# Altium schematic sheet Main.SchDoc
size A3
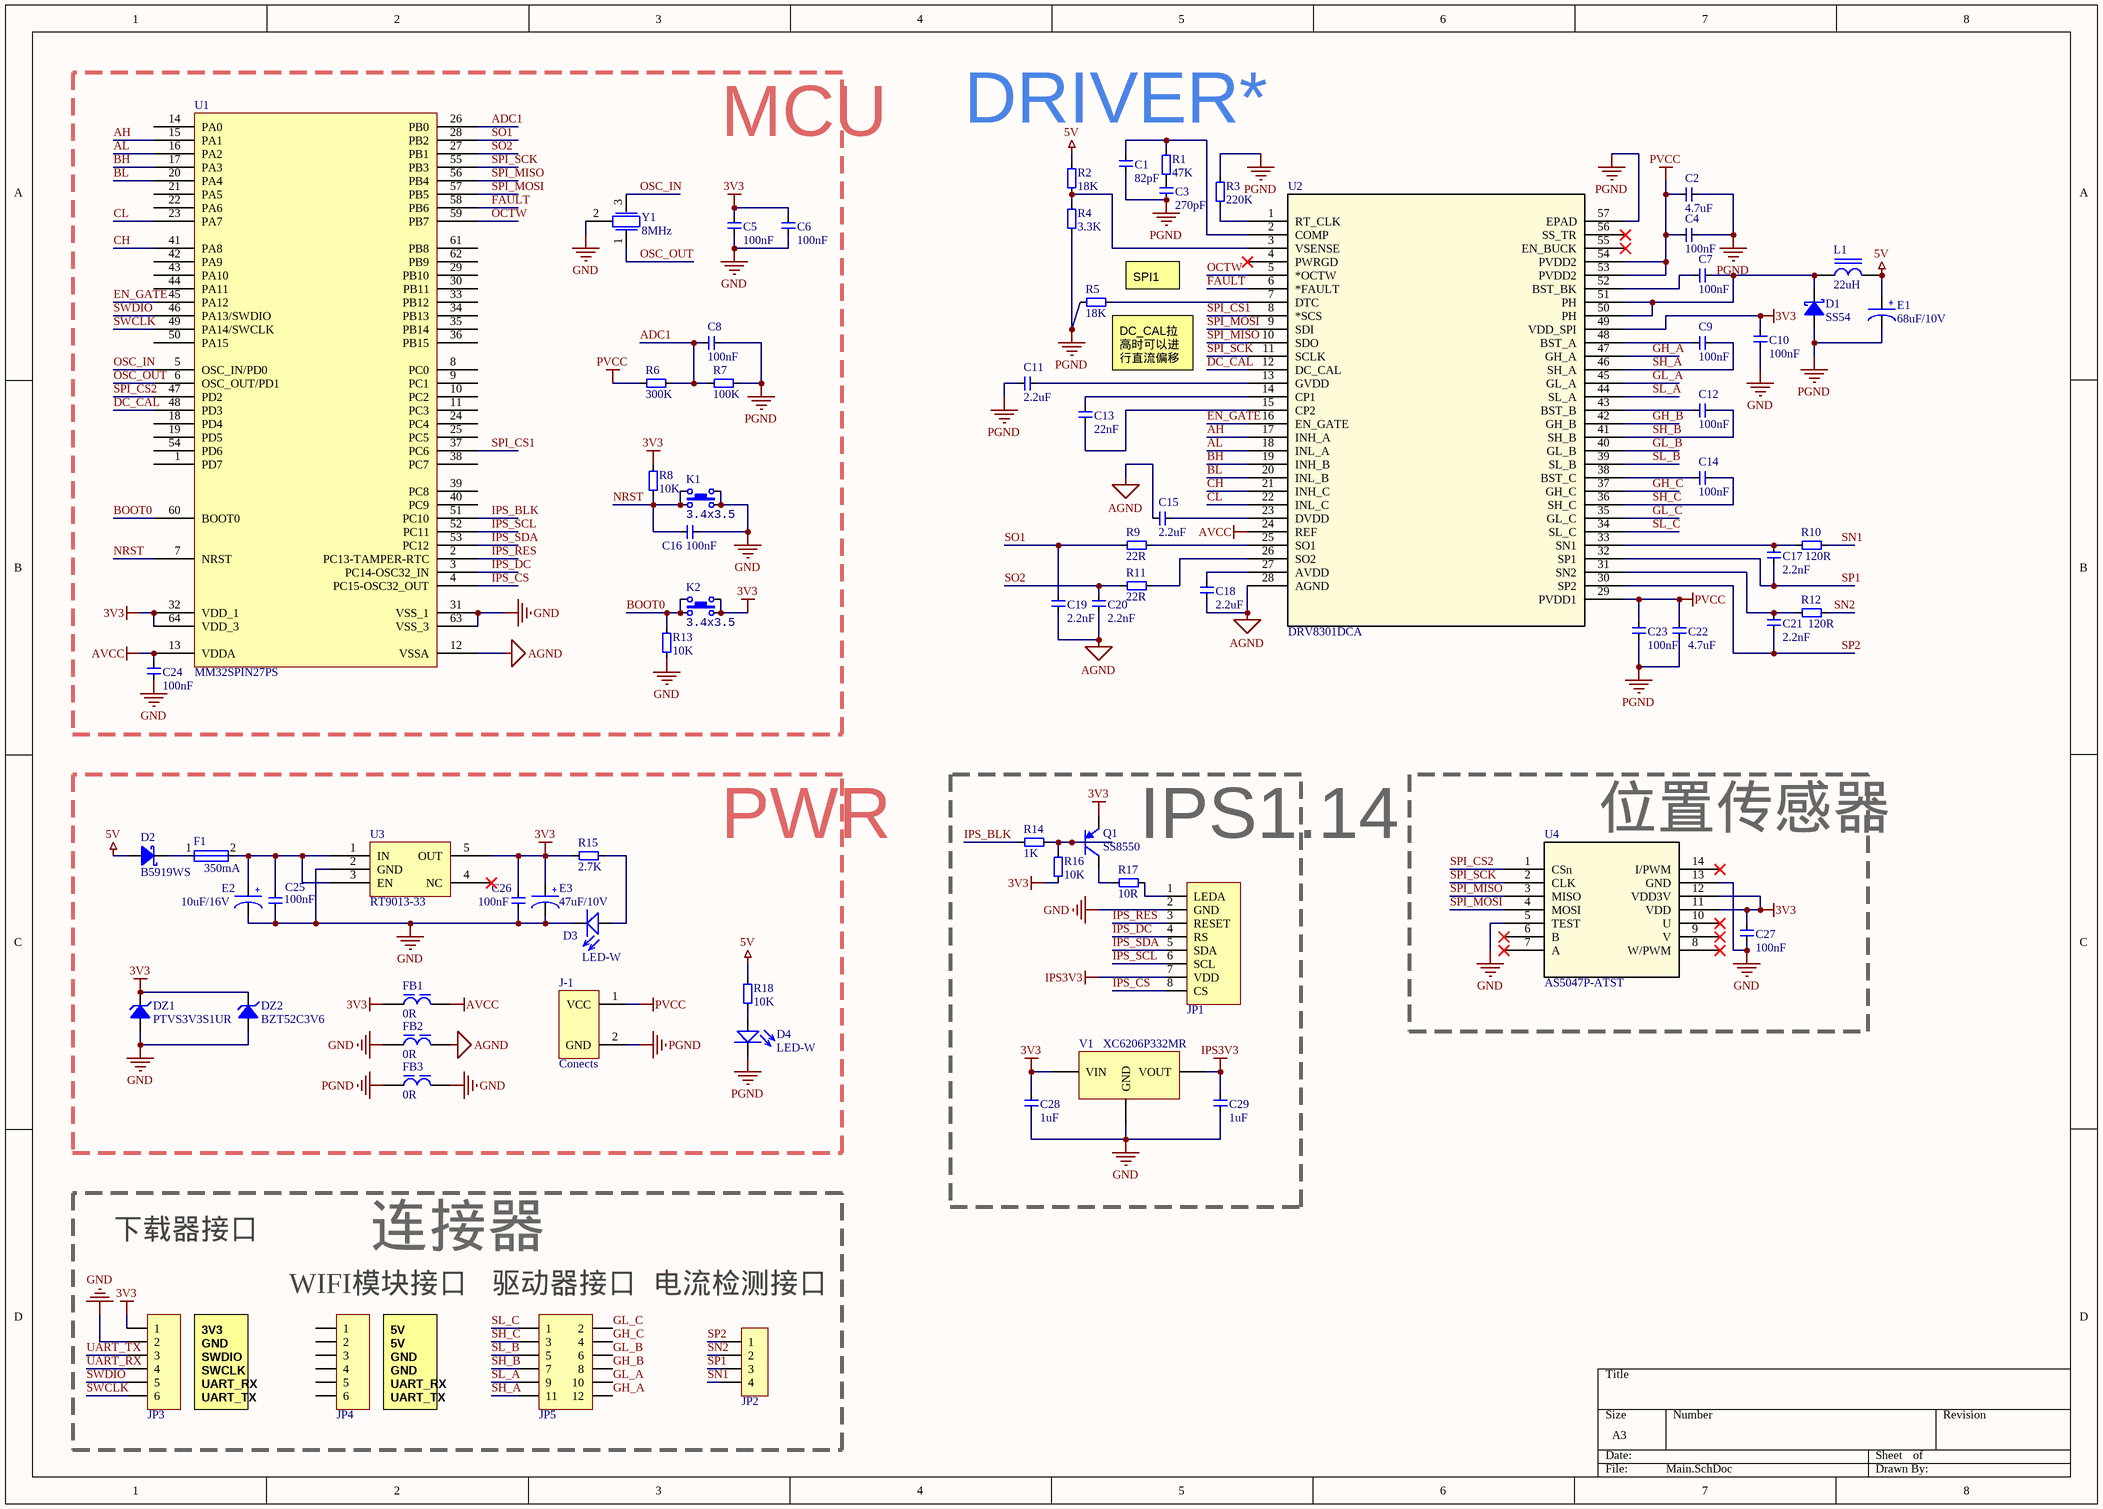
[diagram p0: Main.SchDoc]

## Parts
C1  82pF  [C0402_L]
C2  4.7uF  [C0603_L]
C3  270pF  [C0402_L]
C4  100nF  [C0402_L]
C5  100nF  [C0402_L]
C6  100nF  [C0402_L]
C7  100nF  [C0402_L]
C8  100nF  [C0402_L]
C9  100nF  [C0402_L]
C10  100nF  [C0402_L]
C11  2.2uF  [C0402_L]
C12  100nF  [C0402_L]
C13  22nF  [C0402_L]
C14  100nF  [C0402_L]
C15  2.2uF  [C0402_L]
C16  100nF  [C0402_L]
C17  2.2nF  [C0402_L]
C18  2.2uF  [C0402_L]
C19  2.2nF  [C0402_L]
C20  2.2nF  [C0402_L]
C21  2.2nF  [C0402_L]
C22  4.7uF  [C0603_L]
C23  100nF  [C0402_L]
C24  100nF  [C0402_L]
C25  100nF  [C0402_L]
C26  100nF  [C0402_L]
C27  100nF  [C0402_L]
C28  1uF  [C0402_L]
C29  1uF  [C0402_L]
D1  SS54  [SMB]
D2  B5919WS  [SOD-323]
D3  LED-W  [LED 0402]
D4  LED-W  [LED 0402]
DZ1  PTVS3V3S1UR  [SOD-123]
DZ2  BZT52C3V6  [SOD-123]
E1  68uF/10V  [CE D(6.3*5.4)]
E2  10uF/16V  [C_3528]
E3  47uF/10V  [C_3528]
F1  350mA  [R0805_L]
FB1  0R  [R0603_L]
FB2  0R  [R0603_L]
FB3  0R  [R1206_L]
J-1  Conects  [connecter-PWR]
JP1  IPS1.14  [IPS1.14 FPC0.5 2H-WS-8P]  (value not drawn)
JP2  HDR-1X4  [connecter-stamps-4p]  (value not drawn)
JP3  CON-6P  [SH1.0-6P]  (value not drawn)
JP4  CON-6P  [SH1.0-6P]  (value not drawn)
JP5  Header 6X2  [connecter-stamps-12p]  (value not drawn)
K1  value 3.4x3.5  [ButtonTACT_3.5*3.55_90]  (hidden comment: TACT 4P)
K2  value 3.4x3.5  [ButtonTACT_3.5*3.55_90]  (hidden comment: TACT 4P)
L1  22uH  [NR5040]
Q1  SS8550  [SOT23]
R1  47K  [R0402_L]
R2  18K  [R0402_L]
R3  220K  [R0402_L]
R4  3.3K  [R0402_L]
R5  18K  [R0402_L]
R6  300K  [R0402_L]
R7  100K  [R0402_L]
R8  10K  [R0402_L]
R9  22R  [R0402_L]
R10  120R  [R0402_L]
R11  22R  [R0402_L]
R12  120R  [R0402_L]
R13  10K  [R0402_L]
R14  1K  [R0402_L]
R15  2.7K  [R0402_L]
R16  10K  [R0402_L]
R17  10R  [R0402_L]
R18  10K  [R0402_L]
U1  MM32SPIN27PS  [LQFP64 10x10_L]
U2  DRV8301DCA  [DCA56_6P35X3P61]
U3  RT9013-33  [SOT23-5]
U4  AS5047P-ATST  [TSSOP-14_AMS-L]
V1  XC6206P332MR  [SOT23]
Y1  8MHz  [晶振-3P]

## Blocks framed on the sheet
MCU: C5 C6 C8 C16 C24 K1 K2 R6-R8 R13 U1 Y1
PWR: C25 C26 D2-D4 DZ1 DZ2 E2 E3 F1 FB1-FB3 J-1 R15 R18 U3
IPS1.14: C28 C29 JP1 Q1 R14 R16 R17 V1
位置传感器: C27 U4
连接器: JP2-JP5

## Nets
3V3: C5.2 C6.2 C10.1 C26.1 C27.1 C28.2 DZ1.2(K) DZ2.2(K) E3.1(A) FB1.2 JP3.1 K2.2 K2.4 Q1.2(E) R8.1 R15.1 R16.1 U1.32(VDD_1) U1.64(VDD_3) U2.49(VDD_SPI) U3.5(OUT) U4.11(VDD) U4.12(VDD3V) V1.3(VIN)
5V: D2.1(A) E1.1(A) L1.2 R2.2 R18.1
AGND: C15.1 C18.1 C19.1 C20.1 FB2.1 U1.12(VSSA) U2.28(AGND)
AVCC: C24.2 FB1.1 U1.13(VDDA) U2.24(REF)
GND: C5.1 C6.1 C10.2 C16.2 C24.1 C25.2 C26.2 C27.2 C28.1 C29.1 D3.2 DZ1.1(A) DZ2.1(A) E2.2(K) E3.2(K) FB2.2 FB3.1 JP1.2(GND) JP3.2 K1.2 K1.4 R13.2 U1.31(VSS_1) U1.63(VSS_3) U3.2(GND) U4.5(TEST) U4.13(GND) V1.1(GND) Y1.2
IPS3V3: C29.2 JP1.7(VDD) V1.2(VOUT)
PGND: C1.1 C2.2 C3.1 C4.2 C8.1 C11.1 C22.1 C23.1 D1.1(A) D4.2 E1.2(K) FB3.2 J-1.2(GND) R3.2 R4.1 R5.2 R7.2 U2.57(EPAD)
PVCC: C2.1 C4.1 C22.2 C23.2 J-1.1(VCC) R6.1 U2.29(PVDD1) U2.53(PVDD2) U2.54(PVDD2)
ADC1: C8.2 R6.2 R7.1 U1.26(PB0)
AH: U1.15(PA1) U2.17(INH_A)
AL: U1.16(PA2) U2.18(INL_A)
BH: U1.17(PA3) U2.19(INH_B)
BL: U1.20(PA4) U2.20(INL_B)
BOOT0: K2.1 K2.3 R13.1 U1.60(BOOT0)
CH: U1.41(PA8) U2.21(INH_C)
CL: U1.23(PA7) U2.22(INL_C)
DC_CAL: U1.48(PD3) U2.12(DC_CAL)
EN_GATE: U1.45(PA12) U2.16(EN_GATE)
FAULT: U1.58(PB6) U2.6(*FAULT)
GH_A: JP5.12 U2.47(GH_A)
GH_B: JP5.8 U2.42(GH_B)
GH_C: JP5.4 U2.37(GH_C)
GL_A: JP5.10 U2.45(GL_A)
GL_B: JP5.6 U2.40(GL_B)
GL_C: JP5.2 U2.35(GL_C)
IPS_BLK: R14.1 U1.51(PC10)
IPS_CS: JP1.8(CS) U1.4(PC15-OSC32_OUT)
IPS_DC: JP1.4(RS) U1.3(PC14-OSC32_IN)
IPS_RES: JP1.3(RESET) U1.2(PC13-TAMPER-RTC)
IPS_SCL: JP1.6(SCL) U1.52(PC11)
IPS_SDA: JP1.5(SDA) U1.53(PC12)
NRST: C16.1 K1.1 K1.3 R8.2 U1.7(NRST)
OCTW: U1.59(PB7) U2.5(*OCTW)
OSC_IN: U1.5(OSC_IN/PD0) Y1.3
OSC_OUT: U1.6(OSC_OUT/PD1) Y1.1
SH_A: C9.1 JP5.11 U2.46(SH_A)
SH_B: C12.1 JP5.7 U2.41(SH_B)
SH_C: C14.1 JP5.3 U2.36(SH_C)
SL_A: JP5.9 U2.44(SL_A)
SL_B: JP5.5 U2.39(SL_B)
SL_C: JP5.1 U2.34(SL_C)
SN1: JP2.4 R10.1
SN2: JP2.2 R12.1
SO1: C19.2 R9.2 U1.28(PB2)
SO2: C20.2 R11.2 U1.27(PB1)
SP1: C17.1 JP2.3 U2.32(SP1)
SP2: C21.1 JP2.1 U2.30(SP2)
SPI_CS1: U1.37(PC6) U2.8(*SCS)
SPI_CS2: U1.47(PD2) U4.1(CSn)
SPI_MISO: U1.56(PB4) U2.10(SDO) U4.3(MISO)
SPI_MOSI: U1.57(PB5) U2.9(SDI) U4.4(MOSI)
SPI_SCK: U1.55(PB3) U2.11(SCLK) U4.2(CLK)
SWCLK: JP3.6 U1.49(PA14/SWCLK)
SWDIO: JP3.5 U1.46(PA13/SWDIO)
UART_RX: JP3.4
UART_TX: JP3.3
NetC1_2: C1.2 R1.2 U2.2(COMP)
NetC3_2: C3.2 R1.1
NetC7_1: C7.1 D1.2(K) L1.1 U2.50(PH) U2.51(PH)
NetC7_2: C7.2 U2.52(BST_BK)
NetC9_2: C9.2 U2.48(BST_A)
NetC11_2: C11.2 U2.13(GVDD)
NetC12_2: C12.2 U2.43(BST_B)
NetC13_1: C13.1 U2.15(CP2)
NetC13_2: C13.2 U2.14(CP1)
NetC14_2: C14.2 U2.38(BST_C)
NetC15_2: C15.2 U2.23(DVDD)
NetC17_2: C17.2 R10.2 U2.33(SN1)
NetC18_2: C18.2 U2.27(AVDD)
NetC21_2: C21.2 R12.2 U2.31(SN2)
NetC25_1: C25.1 E2.1(A) F1.2 U3.1(IN) U3.3(EN)
NetD2_2: D2.2(K) F1.1
NetD3_1: D3.1 R15.2
NetD4_1: D4.1 R18.2
NetJP1_1: JP1.1(LEDA) R17.2
NetQ1_1: Q1.1(B) R14.2 R16.2
NetQ1_3: Q1.3(C) R17.1
NetR2_1: R2.1 R4.2 U2.3(VSENSE)
NetR3_1: R3.1 U2.1(RT_CLK)
NetR5_1: R5.1 U2.7(DTC)
NetR9_1: R9.1 U2.25(SO1)
NetR11_1: R11.1 U2.26(SO2)

Not connected (* = marked no-connect by the designer): JP4 1 2 3 4 5 6; U1 1(PD7) 8(PC0) 9(PC1) 10(PC2) 11(PC3) 14(PA0) 18(PD4) 19(PD5) 21(PA5) 22(PA6) 24(PC4) 25(PC5) 29(PB10) 30(PB11) 33(PB12) 34(PB13) 35(PB14) 36(PB15) 38(PC7) 39(PC8) 40(PC9) 42(PA9) 43(PA10) 44(PA11) 50(PA15) 54(PD6) 61(PB8) 62(PB9); U2 4(PWRGD)* 55(EN_BUCK)* 56(SS_TR)*; U3 4(NC)*; U4 6(B)* 7(A)* 8(W/PWM)* 9(V)* 10(U)* 14(I/PWM)*

## Notes on the sheet
- DRIVER*
- (near R5) SPI1
- (near R5) DC_CAL拉高时可以进行直流偏移校准
- 下载器接口
- (near JP4) WIFI模块接口
- (near JP5) 驱动器接口
- (near JP2) 电流检测接口
- (near JP3) 3V3
  GND
  SWDIO
  SWCLK
  UART_RX
  UART_TX
- (near JP4) 5V
  5V
  GND
  GND
  UART_RX
  UART_TX
- (in symbol C-CD) +
- (in symbol C-CM) +

## Library data of the parts
C1-C29 = C: 电容 | 陶瓷电容; BOM名称: 无极性贴片电容; 版权归属: 源创客; 学习资源: www.ooocke.com
D1 = SS54: 二极管 | 肖特基二极管; 属性: 40V/5A; 以赠品形式获赠本封装库的买家，还可联系卖家免费指导AD软件使用: 封装库来自淘宝卖家ID：黄晶宝石; BOM名称: 肖特基二极管
D2 = 1N5819: 二极管 | 肖特基二极管; 以赠品形式获赠本封装库的买家，还可联系卖家免费指导AD软件使用: 封装库来自淘宝卖家ID：黄晶宝石; BOM名称: 肖特基二极管
D3 D4 = LED-White: 二极管 | 白色LED
DZ1 = PTVS3V3S1UR: 二极管 | 齐纳二极管; BOM名称: 30V/0.5W稳压管; 以赠品形式获赠本封装库的买家，还可联系卖家免费指导AD软件使用: 封装库来自淘宝卖家ID：黄晶宝石
DZ2 = BZT52C3V6: 二极管 | 齐纳二极管; BOM名称: 30V/0.5W稳压管; 以赠品形式获赠本封装库的买家，还可联系卖家免费指导AD软件使用: 封装库来自淘宝卖家ID：黄晶宝石
E1 = C-CM: 电容 | 电解电容; BOM名称: 贴片电解电容; 版权归属: 源创客; 学习资源: www.ooocke.com
E2 E3 = C-CD: 电容 | 钽电容; BOM名称: 贴片电解电容; 版权归属: 源创客; 学习资源: www.ooocke.com
F1 = FUSE: 可复位保险丝
FB1-FB3 = FB: 磁珠
J-1 = Conects: 插接件 | 电源接口; BOM名称: USB-A型母接口; 版权归属: 源创客; 学习资源: www.ooocke.com
JP1 = IPS1.14: 显示屏 | 1.14寸液晶显示屏; BOM名称: FPC连接器; 版权归属: 源创客; 学习资源: www.ooocke.com
JP2 = Header 4: 插接件 | 4P接插件; 联系卖家，免费查找封装: 唯一出售店铺网址https://shop463601444.taobao.com; 封装库来自淘宝卖家ID:黄晶宝石: 其他店铺购入均为盗版假冒封装库，请立即申请退款，本店现金奖励20~200元; BOM名称: 4P接插件
JP3 JP4 = SH1.0-6P: 插接件 | SH系列; BOM名称: 6P连接器; 联系卖家 免费查找封装: 唯一出售店铺网址https://shop463601444.taobao.com; 联系卖家 免费技术支持: 封装库来自淘宝卖家ID：黄晶宝石
JP5 = Header  6X2: 插接件 | 6*2P接插件; 联系卖家，免费查找封装: 唯一出售店铺网址https://shop463601444.taobao.com; 封装库来自淘宝卖家ID:黄晶宝石: 其他店铺购入均为盗版假冒封装库，请立即申请退款，本店现金奖励20~200元; BOM名称: 6*2P接插件
K1 K2 = ButtonTACT: 轻触开关 | 3.4x3.5四脚; type: TACT 4P
L1 = L-CD: 电感 | 贴片功率电感; BOM名称: 功率电感; 版权归属: 源创客; 学习资源: www.ooocke.com
Q1 = 8550-DIP: 三极管 | 高频放大-PNP型; 版权归属: 源创客; 属性: 40V 1.5A 1W 100MHZ; BOM名称: 高频放大-PNP型; 学习资源: www.ooocke.com
R1-R18 = R: 电阻 | 贴片电阻; 版权归属: 源创客; BOM名称: 贴片电阻; 学习资源: www.ooocke.com
U1 = MM32SPIN27PS: MCU
U2 = DRV8301DCA: No Description Available; Mfr_Name: Texas Instruments; Copyright: Copyright (C) 2021 Ultra Librarian. All rights reserved.; Manufacturer_Part_Number: DRV8301DCA; RefDes: RefDes; Type: DEV
U3 = RT9013-33: IC | 低压线性稳压器
U4 = AS5047P-ATST: No Description Available; Mfr_Name: ams OSRAM; Copyright: Copyright (C) 2022 Ultra Librarian. All rights reserved.; Manufacturer_Part_Number: AS5047P-ATST; RefDes: RefDes; Type: DEV
V1 = XC6206P332MR: IC | 低压线性稳压芯片; BOM名称: 线性稳压芯片; 版权归属: 源创客; 学习资源: www.ooocke.com
Y1 = 晶振-3Pin: 晶振 | 村田贴片